# EAGLE design Rocket_End (EAGLE 7.1.0)
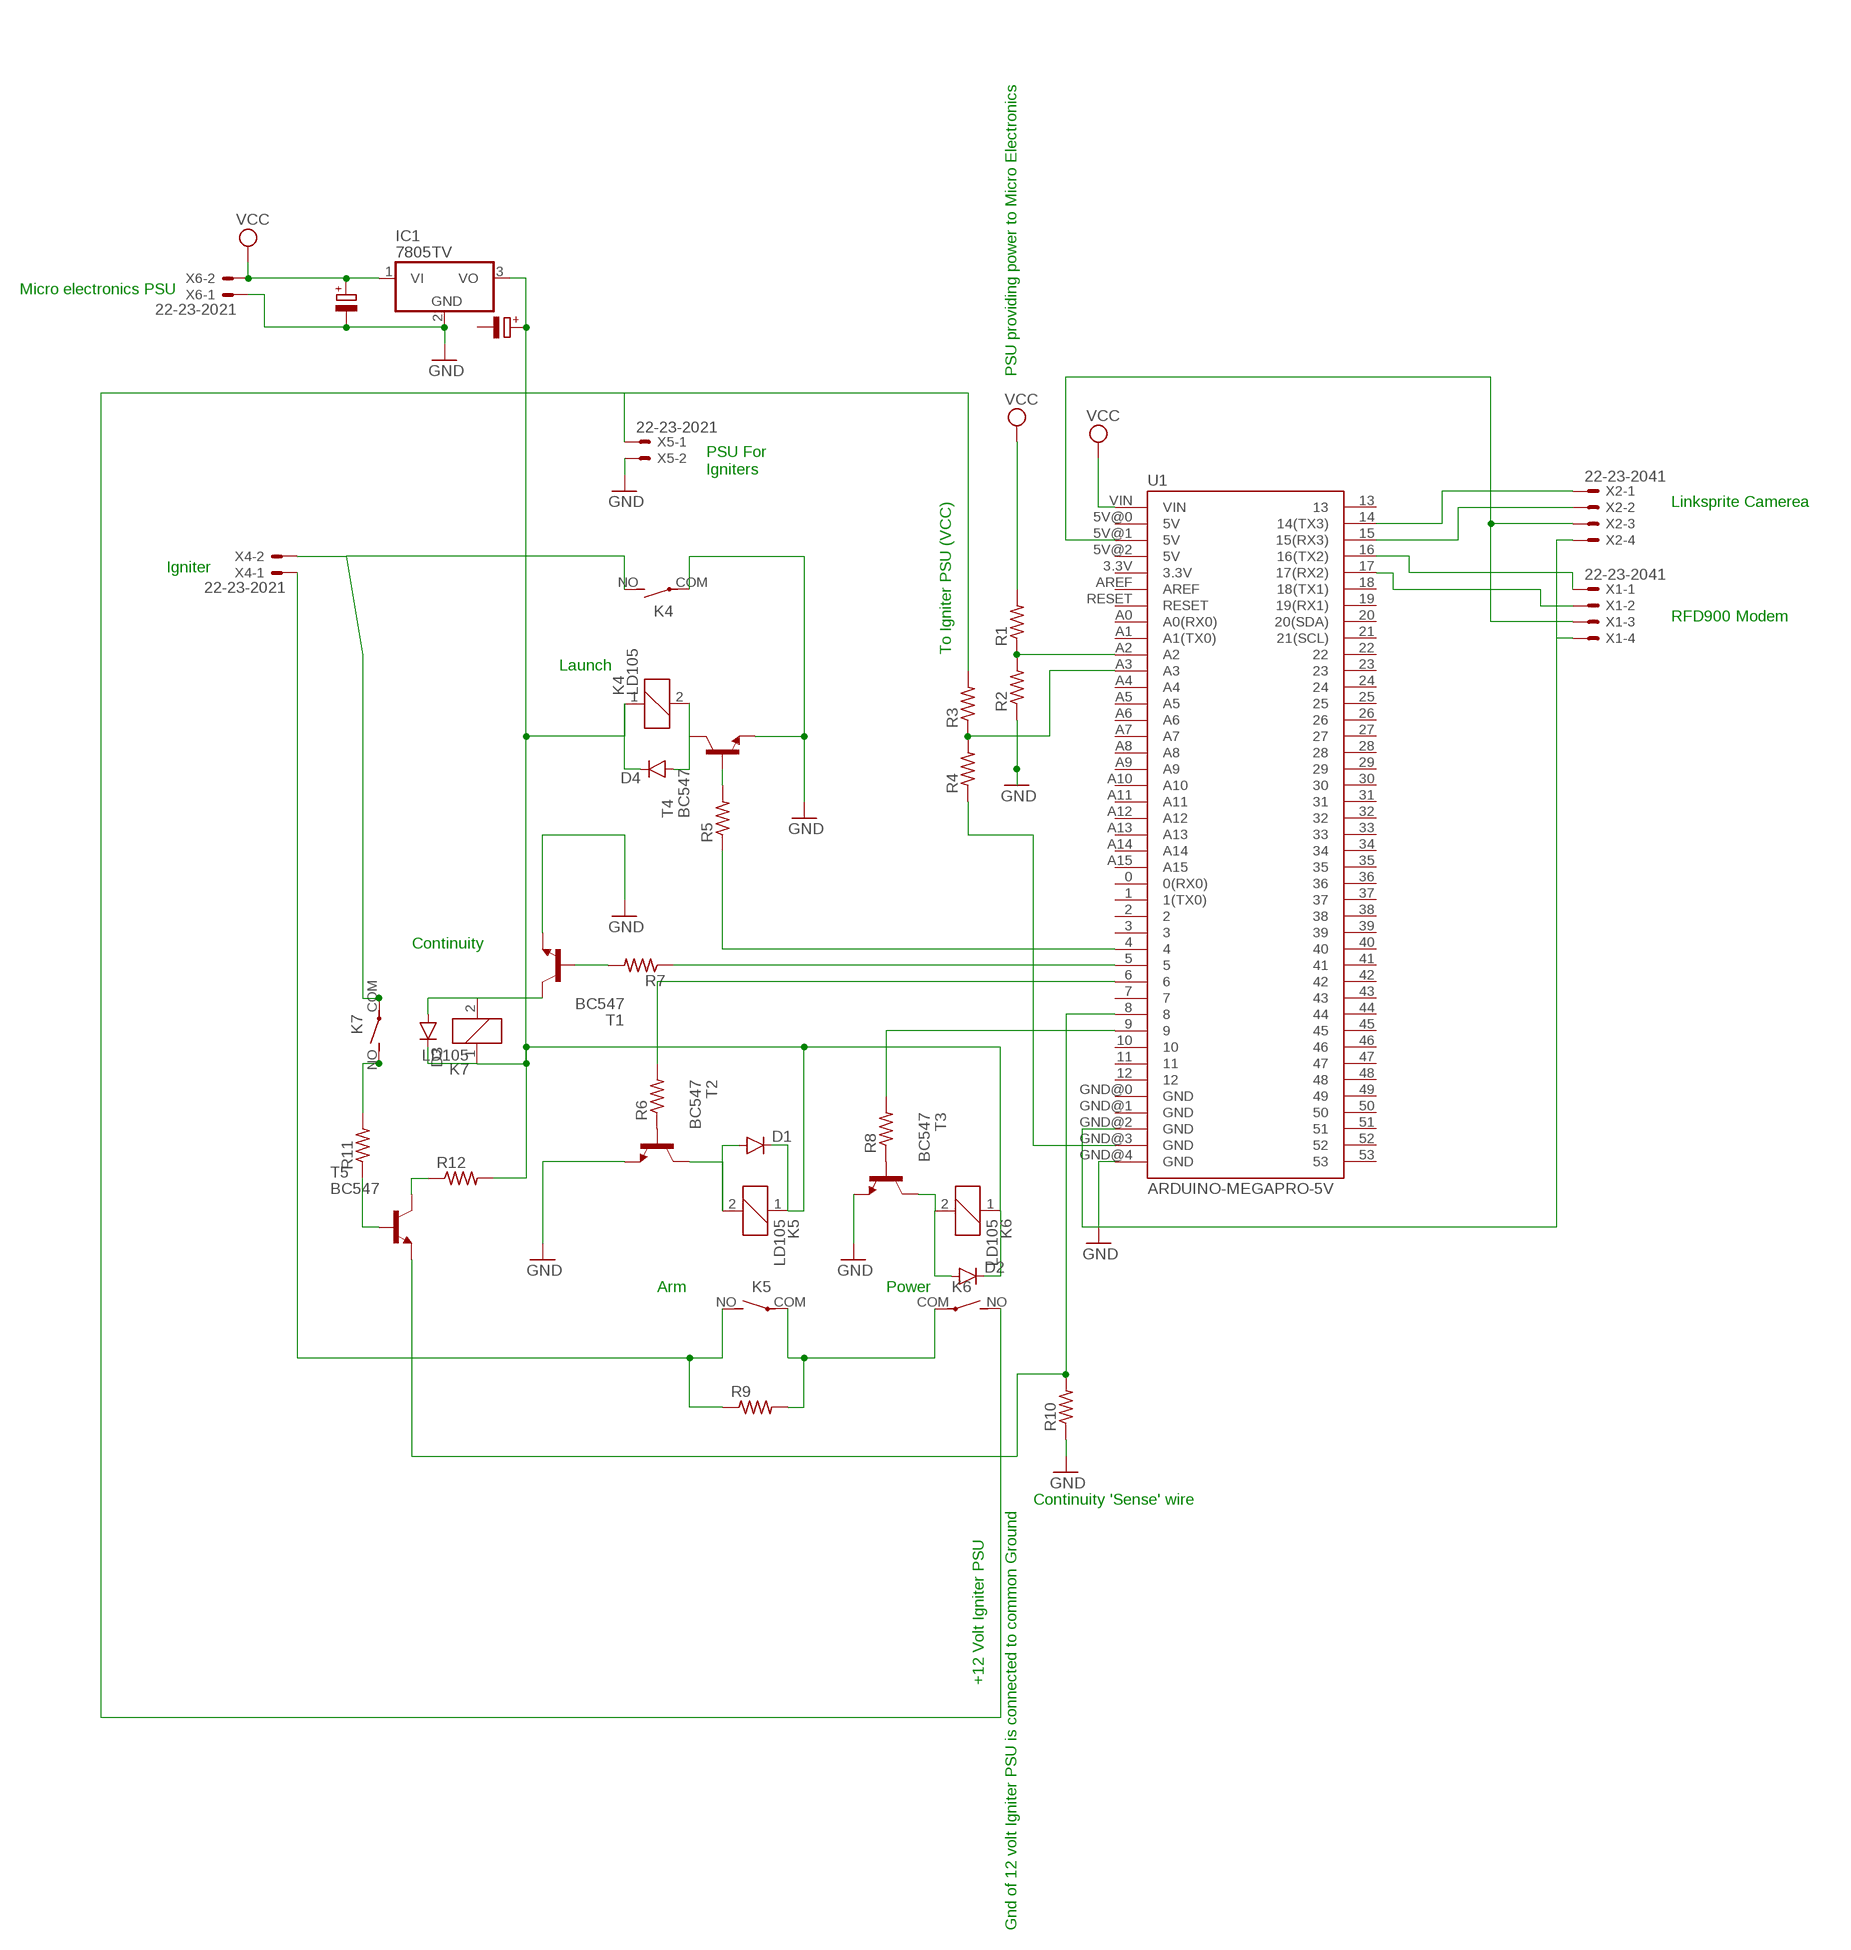
[diagram p0: schematic, sheet 1]

## Parts
D1  DIODE1N4148  [DIODE-1N4148]
D2  DIODE1N4148  [DIODE-1N4148]
D3  DIODE1N4148  [DIODE-1N4148]
D4  DIODE1N4148  [DIODE-1N4148]
IC1  7805TV  [TO220V]
K4  LD105  [LD]
K5  LD105  [LD]
K6  LD105  [LD]
K7  LD105  [LD]
R1  R-US_0204/7  [0204/7]
R2  R-US_0204/7  [0204/7]
R3  R-US_0204/7  [0204/7]
R4  R-US_0204/7  [0204/7]
R5  R-US_0204/7  [0204/7]
R6  R-US_0204/7  [0204/7]
R7  R-US_0204/7  [0204/7]
R8  R-US_0204/7  [0204/7]
R9  R-US_0204/7  [0204/7]
R10  R-US_0207/7  [0207/7]
R11  R-US_0204/7  [0204/7]
R12  R-US_0204/7  [0204/7]
T1  BC547  [TO92]
T2  BC547  [TO92]
T3  BC547  [TO92]
T4  BC547  [TO92]
T5  BC547  [TO92]
U1  ARDUINO-MEGAPRO-5V  [ARDUINO_MEGA-PRO-5V]
X1  22-23-2041  [22-23-2041]
X2  22-23-2041  [22-23-2041]
X4  22-23-2021  [22-23-2021]
X5  22-23-2021  [22-23-2021]
X6  22-23-2021  [22-23-2021]

## Nets
GND: IC1.2(GND) K4.COM(2:P) R2.1 R10.1 T1.1(E) T2.1(E) T3.1(E) T4.1(E) U1.GND@4(GND) X5.2 X6.1
N$1: U1.16(16(TX2)) X1.1
N$2: U1.17(17(RX2)) X1.2
N$3: R3.1 R4.2 U1.A3
N$4: R5.1 U1.4
N$5: D1.C D2.C D3.C D4.C IC1.3(VO) K4.1 K5.1 K6.1 K7.1 R12.2
N$6: U1.14(14(TX3)) X2.1
N$7: R1.1 R2.2 U1.A2
N$8: R7.1 U1.5
N$9: R6.2 U1.6
N$10: R6.1 T2.2(B)
N$11: R8.1 T3.2(B)
N$12: R5.2 T4.2(B)
N$13: R7.2 T1.2(B)
N$14: R8.2 U1.9
N$15: K4.NO(2:S) K7.COM(2:P) X4.2
N$16: U1.GND@2(GND) X1.4 X2.4
N$17: K5.NO(2:S) R9.1 X4.1
N$19: D4.A K4.2 T4.3(C)
N$20: D3.A K7.2 T1.3(C)
N$21: D2.A K6.2 T3.3(C)
N$22: D1.A K5.2 T2.3(C)
N$23: R12.1 T5.3(C)
N$24: R4.1 U1.GND@3(GND)
N$25: K5.COM(2:P) K6.COM(2:P) R9.2
N$26: R10.2 T5.1(E) U1.8
N$27: U1.15(15(RX3)) X2.2
N$28: U1.5V@1(5V) X1.3 X2.3
N$29: K6.NO(2:S) R3.2 X5.1
N$30: K7.NO(2:S) R11.2
N$31: R11.1 T5.2(B)
VCC: IC1.1(VI) R1.2 U1.VIN X6.2
Unconnected: U1.0(0(RX0)) U1.1(1(TX0)) U1.2 U1.3 U1.3.3V U1.5V@0(5V) U1.5V@2(5V) U1.7 U1.10 U1.11 U1.12 U1.13 U1.18(18(TX1)) U1.19(19(RX1)) U1.20(20(SDA)) U1.21(21(SCL)) U1.22 U1.23 U1.24 U1.25 U1.26 U1.27 U1.28 U1.29 U1.30 U1.31 U1.32 U1.33 U1.34 U1.35 U1.36 U1.37 U1.38 U1.39 U1.40 U1.41 U1.42 U1.43 U1.44 U1.45 U1.46 U1.47 U1.48 U1.49 U1.50 U1.51 U1.52 U1.53 U1.A0(A0(RX0)) U1.A1(A1(TX0)) U1.A4 U1.A5 U1.A6 U1.A7 U1.A8 U1.A9 U1.A10 U1.A11 U1.A12 U1.A13 U1.A14 U1.A15 U1.AREF U1.GND@0(GND) U1.GND@1(GND) U1.RESET

## Notes on the sheet
- Micro electronics PSU
- PSU providing power to Micro Electronics
- PSU For
  Igniters
- Linksprite Camerea
- Igniter
- RFD900 Modem
- To Igniter PSU (VCC)
- Launch
- Continuity
- Arm | Power
- Continuity 'Sense' wire
- +12 Volt Igniter PSU
- Gnd of 12 volt Igniter PSU is connected to common Ground

## Library data of the parts
D1-D4 = SparkFun-DiscreteSemi:DIODE: Diode These are standard reverse protection diodes and small signal diodes. SMA package can handle up to about 1A. SOD-323 can handle about 200mA. What the SOD-323 package when ordering, there are some mfgs out there that are 5-pin packages.
IC1 = linear:78*: Positive VOLTAGE REGULATOR Source: http://cache.national.com/ds/LM/LM78L05.pdf http://www.fairchildsemi.com/ds/LM/LM7805.pdf
K4-K7 = relay:LD?*: Slim Power Relay NAiS Source: http://www.mew-europe.com/.. en_ds_61112_0000.pdf; OC_FARNELL: 3727154; OC_NEWARK: unknown
R1-R4 R9 R11 = rcl:R-US_: RESISTOR, American symbol
R5-R8 R10 R12 = resistor:R-US_: RESISTOR, American symbol
T1-T4 = transistor-neu-to92:BC547: NPN TRANSISTOR
T5 = transistor:BC547: NPN TRANSISTOR
U1 = SparkFun-Boards:ARDUINO-MEGA: Arduino Mega board footprint
X1 X2 = con-molex:22-23-2041: .100" (2.54mm) Center Header - 4 Pin; MF: MOLEX; MPN: 22-23-2041; OC_FARNELL: 1462920; OC_NEWARK: 38C0355
X4-X6 = con-molex:22-23-2021: .100" (2.54mm) Center Header - 2 Pin; MF: MOLEX; MPN: 22-23-2021; OC_FARNELL: 1462926; OC_NEWARK: 25C3832

## Board
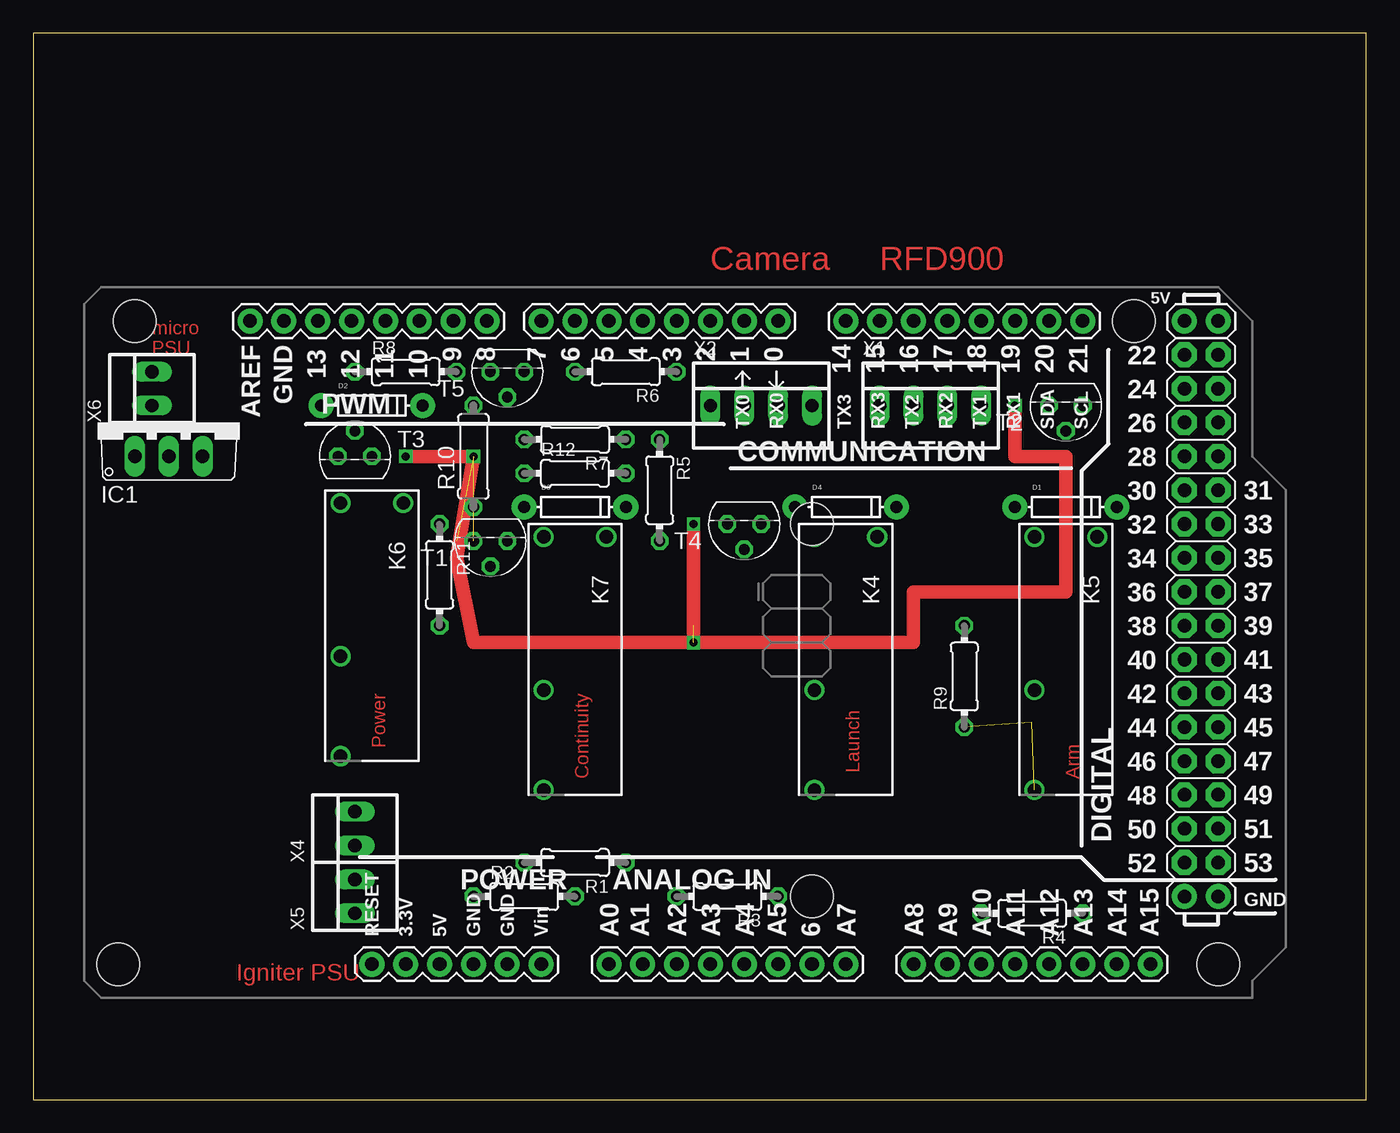
[diagram p1: board, top side]
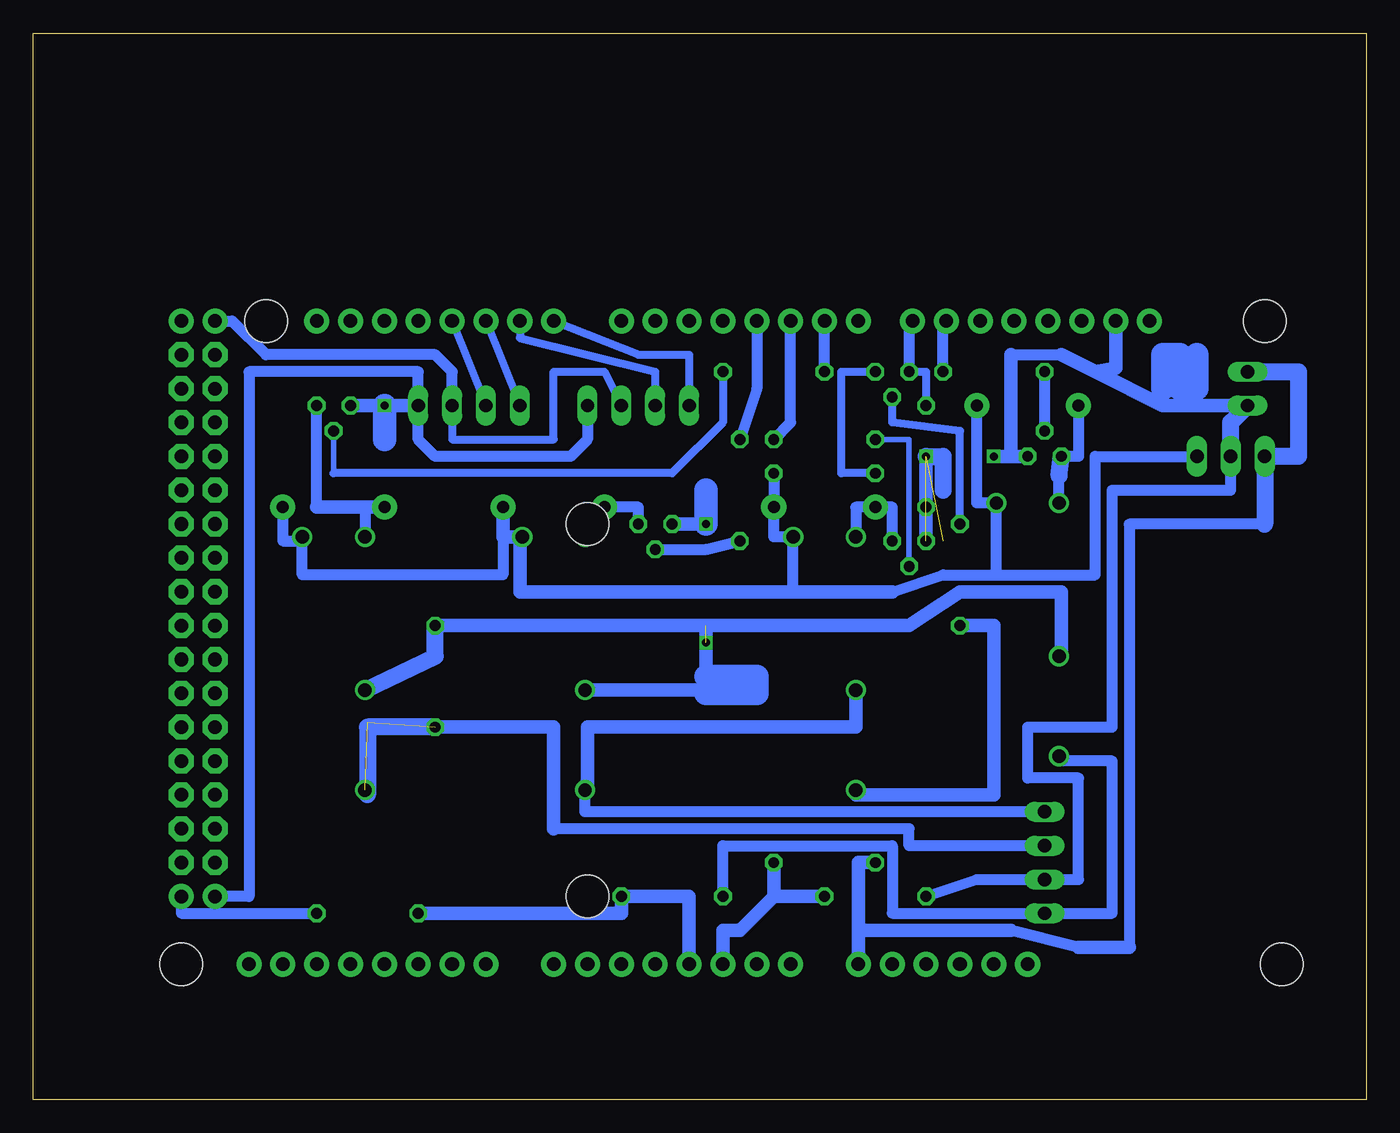
[diagram p2: board, bottom side, seen from below]

Size 100 x 80 mm. Coordinates in mm from the lower left corner, seen from the top.
Outline: 0,0 100,0 100,80 0,80 0,0
Copper layers (1*16): Top 0.035mm / dielectric 1.5mm / Bottom 0.035mm
Design rules "default": minimum track width 10mil, minimum drill 24mil, track to track 8mil, track to pad 8mil, pad to pad 8mil, via to via 8mil, smd to smd 8mil, copper to edge 40mil, drill to drill 8mil, minimum pad ring 10mil, minimum via ring 8mil, stop-mask expansion 4mil, vias tented up to drill 0mil, thermal gap 10mil

### Footprints (pad centres in the part's own frame; a part is rotated, then mirrored left to right if it is on the bottom)
DIODE-1N4148 = drill 0.9 pad 1.88: A -3.81,0; C 3.81,0
TO220V = drill 1.016 long: 1 -2.54,-2.54; 2 0,-2.54; 3 2.54,-2.54
LD = drill 1: 1 -9.2,2.35; 2 -9.2,-2.35; COM 2.3,-2.35; NO 9.8,-2.35
0204/7 = drill 0.813 octagon: 1 -3.81,0; 2 3.81,0
0207/7 = drill 0.813 octagon: 1 -3.81,0; 2 3.81,0
TO92 = drill 0.813 octagon: 1 1.27,0; 2 0,1.905; 3 -1.27,0
ARDUINO_MEGA-PRO-5V = drill 1.016 pad 1.88: 0 52.07,50.8; 1 49.53,50.8; 2 46.99,50.8; 3 44.45,50.8; 3.3V 24.13,2.54; 4 41.91,50.8; 5 39.37,50.8; 5V@0 26.67,2.54; 5V@1 82.55,50.8; 5V@2 85.09,50.8; 6 36.83,50.8; 7 34.29,50.8; 8 30.226,50.8; 9 27.686,50.8; 10 25.146,50.8; 11 22.606,50.8; 12 20.066,50.8; 13 17.526,50.8; 14 57.15,50.8; 15 59.69,50.8; 16 62.23,50.8; 17 64.77,50.8; 18 67.31,50.8; 19 69.85,50.8; 20 72.39,50.8; 21 74.93,50.8; A0 39.37,2.54; A1 41.91,2.54; A2 44.45,2.54; A3 46.99,2.54; A4 49.53,2.54; A5 52.07,2.54; A6 54.61,2.54; A7 57.15,2.54; A8 62.23,2.54; A9 64.77,2.54; A10 67.31,2.54; A11 69.85,2.54; A12 72.39,2.54; A13 74.93,2.54; A14 77.47,2.54; A15 80.01,2.54; AREF 12.446,50.8; GND@0 29.21,2.54; GND@1 31.75,2.54; GND@2 82.55,7.62; GND@3 85.09,7.62; GND@4 14.986,50.8; RESET 21.59,2.54; VIN 34.29,2.54 | drill 1.016 pad 1.88 octagon: 22 82.55,48.26; 23 85.09,48.26; 24 82.55,45.72; 25 85.09,45.72; 26 82.55,43.18; 27 85.09,43.18; 28 82.55,40.64; 29 85.09,40.64; 30 82.55,38.1; 31 85.09,38.1; 32 82.55,35.56; 33 85.09,35.56; 34 82.55,33.02; 35 85.09,33.02; 36 82.55,30.48; 37 85.09,30.48; 38 82.55,27.94; 39 85.09,27.94; 40 82.55,25.4; 41 85.09,25.4; 42 82.55,22.86; 43 85.09,22.86; 44 82.55,20.32; 45 85.09,20.32; 46 82.55,17.78; 47 85.09,17.78; 48 82.55,15.24; 49 85.09,15.24; 50 82.55,12.7; 51 85.09,12.7; 52 82.55,10.16; 53 85.09,10.16 | hole 3.2: 3.81,50.8; 2.54,2.54; 54.61,35.56; 54.61,7.62; 78.74,50.8; 85.09,2.54
22-23-2041 = drill 1 long: 1 -3.81,0; 2 -1.27,0; 3 1.27,0; 4 3.81,0
22-23-2021 = drill 1 long: 1 -1.27,0; 2 1.27,0

### Placement (x,y rotation side)
D1  77.47,44.45 0 top
D2  25.4,52.07 0 top
D3  40.64,44.45 0 top
D4  60.96,44.45 0 top
IC1  10.16,50.8 0 top
K4  60.96,33.02 270 top
K5  77.47,33.02 270 top
K6  25.4,35.56 270 top
K7  40.64,33.02 270 top
R1  40.64,17.78 180 top
R2  36.83,15.24 0 top
R3  52.07,15.24 180 top
R4  74.93,13.97 180 top
R5  46.99,45.72 270 top
R6  44.45,54.61 180 top
R7  40.64,49.53 180 top
R8  27.94,54.61 0 top
R9  69.85,31.75 90 top
R10  33.02,48.26 90 top
R11  30.48,39.37 270 top
R12  40.64,46.99 0 top
T1  34.29,41.91 180 top
T2  77.47,52.07 180 top
T3  24.13,48.26 0 top
T4  53.34,43.18 180 top
T5  35.56,54.61 180 top
U1  3.81,7.62 0 top
X1  67.31,52.07 0 top
X2  54.61,52.07 0 top
X4  24.13,20.32 90 top
X5  24.13,15.24 90 top
X6  8.89,53.34 90 top

### Tracks (layer width: path | path; a pad name or v marks a point on that pad's centre or on a via)
GND  (via drill 0.6)  (3 unrouted)
  Top 1.016: v27.94,48.26 v33.02,48.26 31.75,40.64 33.02,34.29 49.53,34.29 | 49.53,34.29 v49.53,43.18 | 49.53,34.29 66.04,34.29 66.04,38.1 77.47,38.1 77.47,48.26 73.66,48.26 v73.66,52.07
  Bottom 0.813: 26.67,48.26 T3.1 | 26.67,55.88 22.86,55.88 | R2.1 29.21,16.51 X5.2 21.59,16.51 21.59,24.13 25.4,24.13 25.4,27.94 19.05,27.94 19.05,45.72 10.16,45.72 IC1.2
  Bottom 1.016: U1.GND@4 18.8,54.86 20.32,54.61 | 22.86,55.88 20.32,54.61 | 20.32,54.61 15.24,52.07 X6.1 | 26.67,55.88 26.67,48.26 | T1.1 R10.1 v33.02,48.26 | v27.94,48.26 T3.1 | v49.53,43.18 T4.1 | K4.COM 49.53,30.72 49.53,31.75 49.53,35.56 | 71.12,52.07 v73.66,52.07 T2.1
  Bottom 1.27: IC1.2 10.16,50.8 X6.1 | v33.02,48.26 31.75,48.26 31.75,45.72
  Bottom 1.778: v49.53,43.18 49.53,45.72 | v73.66,52.07 73.66,49.53 | 49.53,31.75 45.72,31.75 45.72,30.48 49.53,30.48
N$1
  Bottom 0.61: U1.16 X1.1
N$2
  Bottom 0.61: U1.17 X1.2
N$3
  Bottom 1.016: U1.A3 50.8,15.24 R3.1 55.88,13.97 R4.2
N$4
  Bottom 0.813: U1.4 45.72,53.34 R5.1
N$5
  Bottom 0.406: 79.82,41.91 K5.1 | K6.1 27.94,43.49 27.94,39.37
  Bottom 0.813: D1.C 81.28,41.91 79.82,41.91 | D4.C 64.77,39.37 79.82,39.37 K5.1 | R12.2 D3.C 44.45,42.22 K7.1 42.99,38.1 | 35.56,38.1 31.75,39.37 27.94,39.37 27.75,39.37 | 27.75,39.37 K6.1 29.21,44.76 D2.C | 27.75,39.37 20.32,39.37 20.32,48.26 IC1.3
  Bottom 1.016: K4.1 63.5,42.22 | 63.5,42.22 64.77,42.22 D4.C | 35.56,38.1 42.99,38.1 63.5,38.1 63.5,42.22
N$6
  Bottom 0.61: U1.14 54.61,55.88 50.8,55.88 X2.1
N$7
  Bottom 1.016: R1.1 44.45,15.24 | 44.45,15.24 R2.2 44.45,15.24 | U1.A2 48.26,12.7 46.99,12.7 44.45,15.24
N$8
  Bottom 0.813: R7.1 43.18,50.8 U1.5
N$9
  Bottom 0.813: R6.2 U1.6
N$10
  Bottom 0.406: 77.47,46.99 T2.2
  Bottom 0.61: R6.1 48.26,50.8 52.07,46.99 77.47,46.99
N$11
  Bottom 0.813: R8.1 T3.2
N$12
  Bottom 0.813: T4.2 49.53,41.27 R5.2
N$13
  Bottom 0.406: T1.2 34.29,49.53 R7.2
N$14
  Bottom 0.406: 31.75,58.17 U1.9
  Bottom 0.813: R8.2 31.75,58.17
N$15
  Bottom 0.406: K4.NO 58.42,23.22 | 38.1,27.94 38.29,27.94
  Bottom 0.813: X4.2 58.61,21.59 K4.NO
  Bottom 1.016: 58.42,23.22 58.42,27.94 38.29,27.94 K7.COM
N$16
  Bottom 0.813: X2.4 58.42,49.53 59.69,48.26 69.85,48.26 71.12,49.53 X1.4 71.12,54.61 83.82,54.61 83.82,15.24 U1.GND@2
N$17  (2 unrouted)
  Bottom 0.813: X4.1 34.29,19.05 34.29,20.32 60.96,20.32
  Bottom 1.016: 60.96,20.32 60.96,27.94 R9.1
  Bottom 1.27: R9.1 74.93,27.94 74.93,22.86
N$18  (via drill 0.6)
  other vias: 49.53,34.29
N$19
  Bottom 0.406: D4.A 58.61,44.45
  Bottom 0.813: 58.61,44.45 K4.2 | T4.3 54.61,44.45 D4.A
N$20
  Bottom 0.813: K7.2 38.29,44.45 D3.A 35.56,44.45 T1.3
N$21
  Bottom 0.813: K6.2 23.05,46.8 | D2.A 21.59,48.26 T3.3
  Bottom 1.27: 23.05,46.8 T3.3
N$22
  Bottom 0.813: D1.A 75.12,44.45 K5.2 | 78.74,44.45 T2.3
  Bottom 1.016: D1.A 78.74,44.45
N$23
  Bottom 0.61: R12.1 39.37,46.99 39.37,54.61 T5.3
N$24
  Bottom 0.813: U1.GND@3 88.9,13.97 R4.1
N$25
  Bottom 1.016: R9.2 34.29,35.56 30.48,38.1 22.86,38.1 22.86,33.45 K6.COM
  Bottom 1.27: K5.COM 69.85,33.26 R9.2
N$26
  Bottom 0.406: U1.8 34.29,58.42
  Bottom 0.61: T5.1 33.02,54.61 R10.2
  Bottom 0.813: 34.29,58.42 T5.1
N$27
  Bottom 0.61: U1.15 63.5,57.15 53.34,54.61 X2.2
N$28
  Bottom 0.61: X1.3 68.58,49.53 60.96,49.53 60.96,54.61 57.15,54.61 X2.3
  Bottom 0.813: U1.5V@1 85.09,58.42 82.55,55.88 69.85,55.88 68.58,54.61 X1.3
N$29
  Bottom 0.813: K6.NO 23.05,25.4 19.05,25.4 19.05,13.97 X5.1 35.56,13.97 35.56,19.05 48.26,19.05 R3.2
N$30
  Bottom 0.406: 38.29,22.86 K7.NO
  Bottom 1.016: R11.2 27.94,35.56 27.94,22.86 38.29,22.86
N$31
  Bottom 0.61: R11.1 30.48,50.16 35.56,50.8 T5.2
N$33
  Bottom 1.778: 12.7,55.88 12.7,53.34 13.97,53.34 13.97,55.88 15.24,55.88 15.24,53.34
VCC
  Bottom 0.813: 7.62,43.18 17.78,43.18 17.78,11.43 | 21.59,11.43 26.67,12.7
  Bottom 1.016: 17.78,11.43 21.59,11.43 | 26.67,12.7 38.1,12.7 | 38.1,12.7 U1.VIN | R1.2 38.1,17.78 38.1,12.7
  Bottom 1.27: 7.62,43.18 IC1.1 5.08,48.26 5.08,54.61 X6.2

### Text on the board
Top: Camera | RFD900 | micro / PSU | Power | Continuity | Launch | Arm | Igniter PSU